# Altium schematic sheet RADC-Peripherals-S06-V00.SchDoc: RADC Peripherals (SD Card, I2C / OLED Header, USART Header)
size A3; DrawnBy: Jonn Dillon; DocumentNumber: 5; SheetNumber: 5; SheetTotal: 8; Version: 00; Project: QUTMS RADIO COMPUTE; PageSetup: Record=PageOptions|CenterHorizontal=True|CenterVertical=True|PrintScale=0.97|XCorrection=1.00|YCorrection=1.00|PrintKind=0|BorderSize=5000000|LeftOffset=0|BottomOffset=0|Orientation=2|PaperLength=1000|PaperWidth=1000|Scale=100|PaperSource=7|PrintQuality=-4|MediaType=1|DitherType=10|PaperKind=A4|PrintScaleMode=1
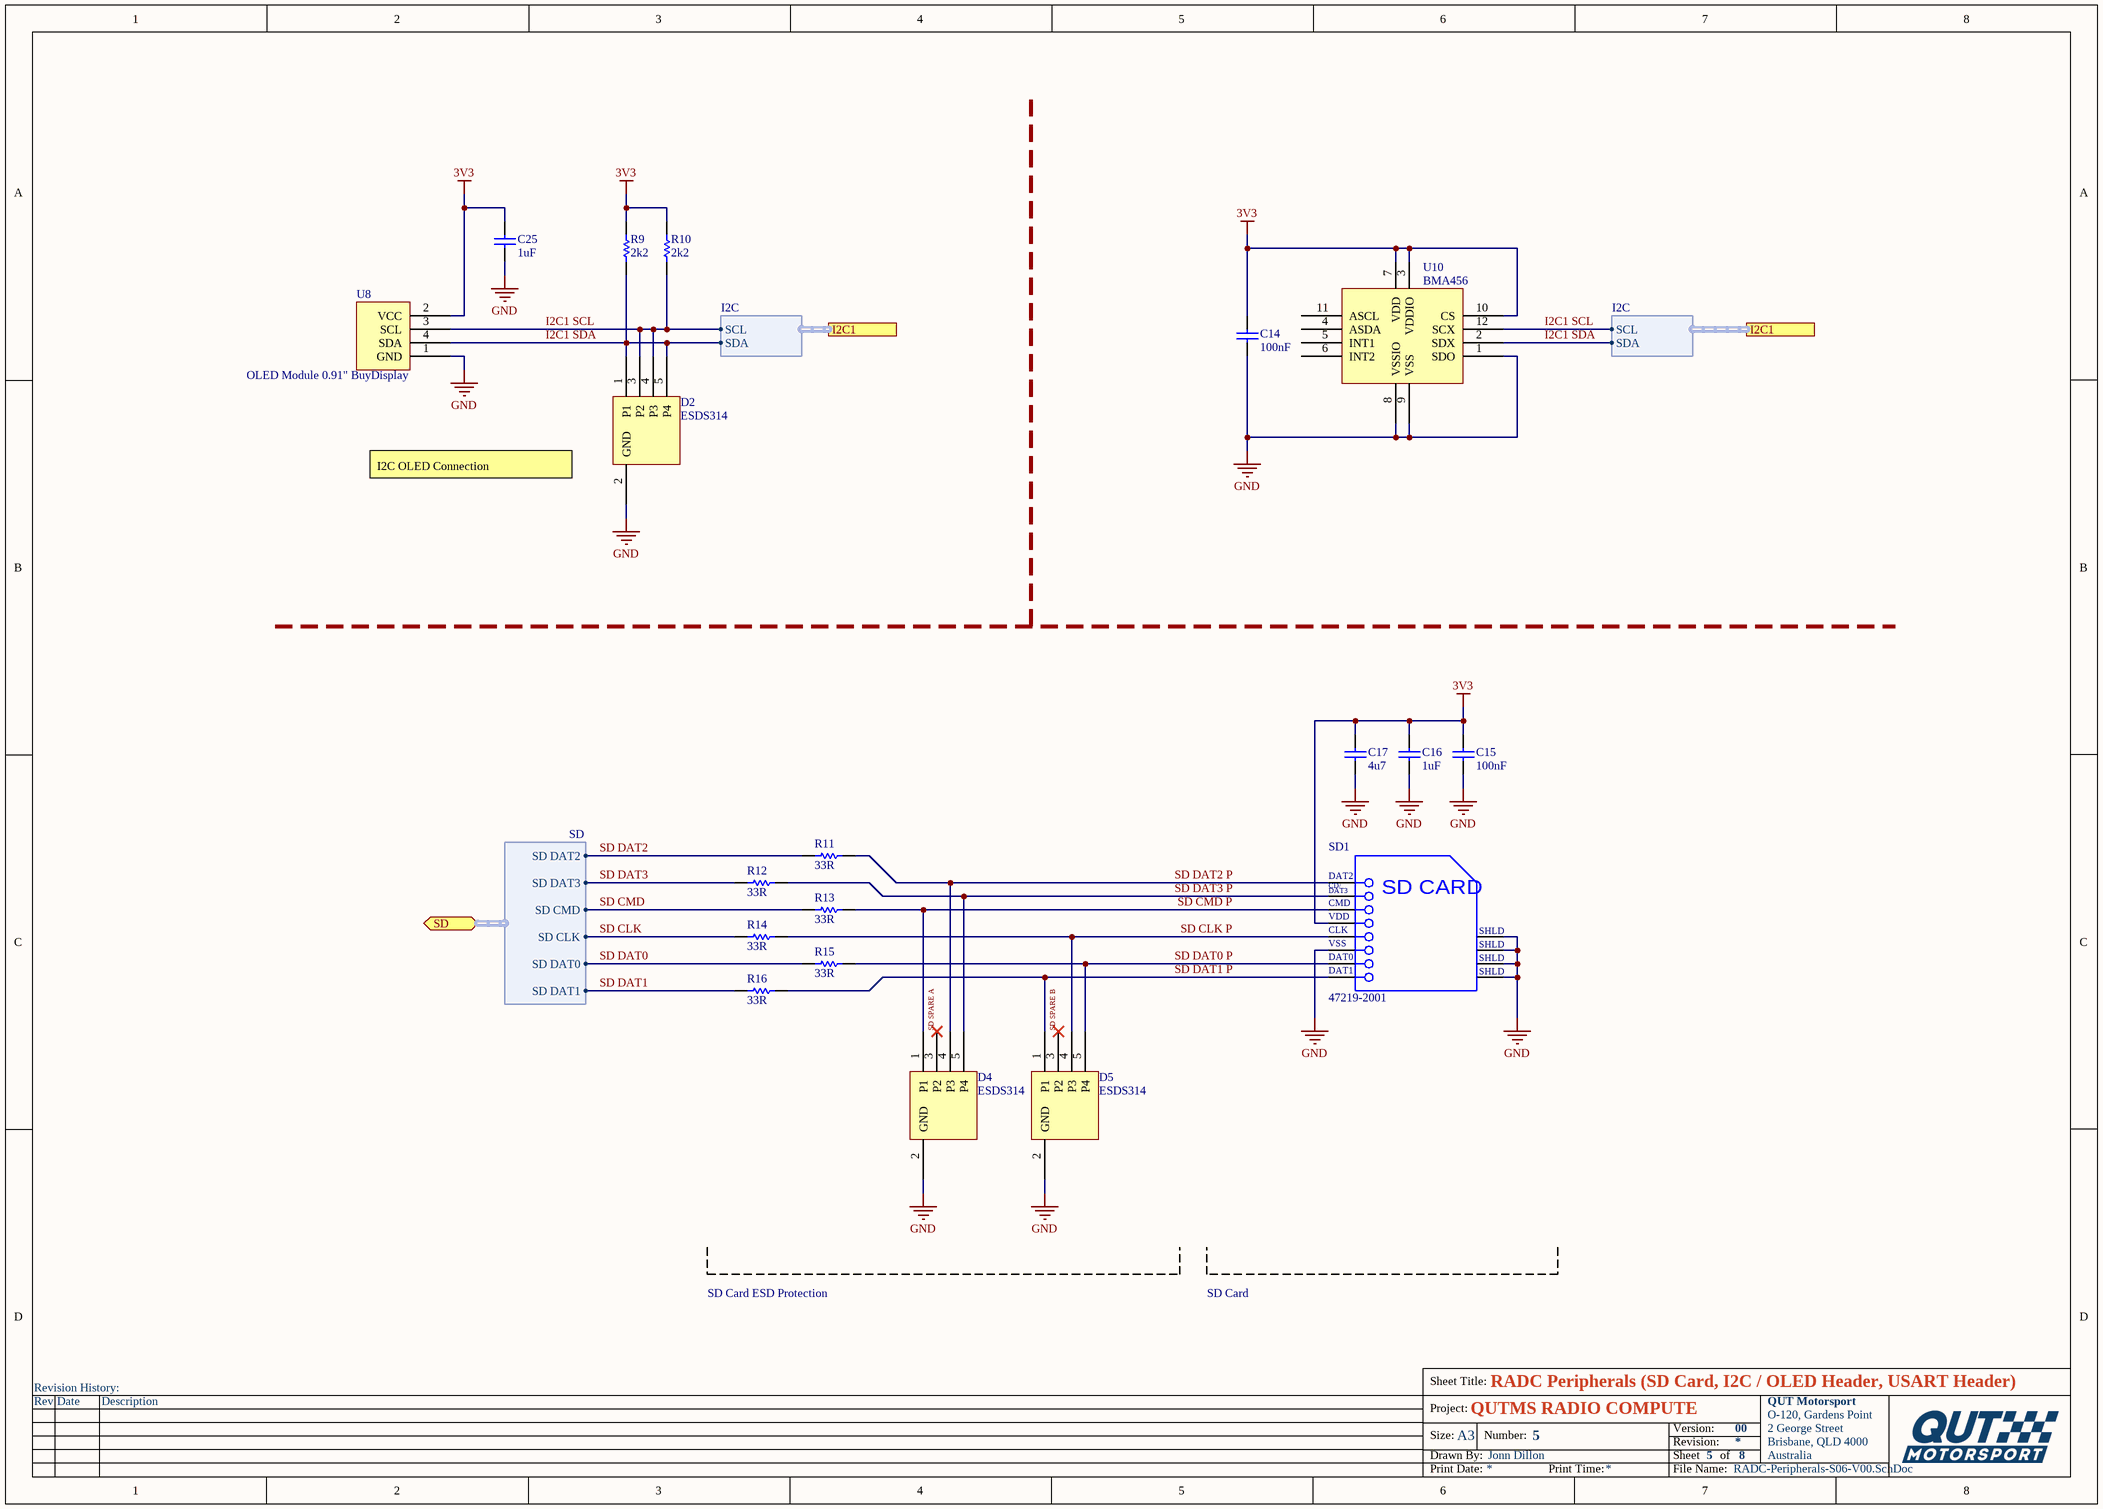
[diagram p0: RADC-Peripherals-S06-V00.SchDoc]

## Parts
C14  100nF  [Cap_Ceramic_0603]
C15  100nF  [Cap_Ceramic_0603]
C16  1uF  [Cap_Ceramic_0603]
C17  4u7  [Cap_Ceramic_0603]
C25  1uF  [Cap_Ceramic_0603]
D2  ESDS314  [SOT-23-5]
D4  ESDS314  [SOT-23-5]
D5  ESDS314  [SOT-23-5]
R9  2k2  [Res_ThinFilm_0603]
R10  2k2  [Res_ThinFilm_0603]
R11  33R  [Res_ThinFilm_0603]
R12  33R  [Res_ThinFilm_0603]
R13  33R  [Res_ThinFilm_0603]
R14  33R  [Res_ThinFilm_0603]
R15  33R  [Res_ThinFilm_0603]
R16  33R  [Res_ThinFilm_0603]
SD1  47219-2001  [47219-2001]
U8  OLED Module 0.91" BuyDisplay  [BuyDisplay 0.91" OLED]
U10  BMA456  [BMA456]

## Ports
I2C1 (harness I2C), SD (bidir, harness SD)

## Harnesses
SD: SD DAT2, SD DAT3, SD CMD, SD CLK, SD DAT0, SD DAT1
I2C: SDA, SCL

## Nets
3V3: C14.2 C15.2 C16.2 C17.2 C25.2 R9.2 R10.2 SD1.4(VDD) U8.2(VCC) U10.3(VDDIO) U10.7(VDD) U10.10(CS)
GND: C14.1 C15.1 C16.1 C17.1 C25.1 D2.2(GND) D4.2(GND) D5.2(GND) SD1.6(VSS) SD1.9(SHLD) SD1.10(SHLD) SD1.11(SHLD) SD1.12(SHLD) U8.1(GND) U10.1(SDO) U10.8(VSSIO) U10.9(VSS)
I2C1 SCL: D2.3(P2) D2.4(P3) R10.1 U8.3(SCL) U10.12(SCX) ; port I2C1.SCL
I2C1 SDA: D2.1(P1) D2.5(P4) R9.1 U8.4(SDA) U10.2(SDX) ; port I2C1.SDA
SD CLK: R14.1 ; port SD.SD CLK
SD CLK P: D5.4(P3) R14.2 SD1.5(CLK)
SD CMD: R13.1 ; port SD.SD CMD
SD CMD P: D4.1(P1) R13.2 SD1.3(CMD)
SD DAT0: R15.1 ; port SD.SD DAT0
SD DAT0 P: D5.5(P4) R15.2 SD1.7(DAT0)
SD DAT1: R16.1 ; port SD.SD DAT1
SD DAT1 P: D5.1(P1) R16.2 SD1.8(DAT1)
SD DAT2: R11.1 ; port SD.SD DAT2
SD DAT2 P: D4.4(P3) R11.2 SD1.1(DAT2)
SD DAT3: R12.1 ; port SD.SD DAT3
SD DAT3 P: D4.5(P4) R12.2 SD1.2(CD/DAT3)
SD SPARE A: D4.3(P2)
SD SPARE B: D5.3(P2)

Not connected (* = marked no-connect by the designer): U10 4(ASDA) 5(INT1) 6(INT2) 11(ASCL)

## Notes on the sheet
- I2C OLED Connection
- SD Card ESD Protection
- SD Card
- Revision History:
- Sheet Title:
- Rev
- Date
- Description
- Project:
- Size:
- Drawn By:
- A3
- Number:
- Revision:
- Sheet
- Version:
- of
- QUT Motorsport
- O-120, Gardens Point
- 2 George Street
- Brisbane, QLD 4000
- Australia
- Print Date:
- Print Time:
- File Name:
- (in symbol 47219-2001) CD/; DAT3; SD CARD

## Library data of the parts
C14 C15 = 100nF 50V 5% X7R 0603: Capacitor, Ceramic, SMD, 100nF, 50V, 5%, X7R, 0603
C16 C25 = 1uF 25V 5% X7R 0603: Capacitor, Ceramic, SMD, 1uF, 25V, 5%, X7R, 0603
C17 = 4u7 50V 5% X7R 0603: Capacitor, Ceramic, SMD, 4u7, 50V, 5%, X7R, 0603
D2 D4 D5 = ESDS314: 6.5V (Typ) Clamp 25A (8/20µs) Ipp Tvs Diode Surface Mount SOT-23-5
R9 R10 = 2k2 5% 0603: Resistor, SMD, 2k2, 0.1W, 5%, 0603
R11-R16 = 33R 5% 0603: Resistor, SMD, 33R, 0.1W, 5%, 0603
SD1 = 47219-2001: MicroSD Card Connector, Hinge Type, -40 to 85 degC, 8-Pin SMD, RoHS, Tape and Reel
U8 = OLED Module 0.91" BuyDisplay: I2C Blue 0.91" inch OLED Display Module 128x32 Arduino,Raspberry Pi
U10 = BMA456: Accelerometer X, Y, Z Axis ±2g, 4g, 8g, 16g 1.5kHz ~ 1.6kHz 12-LGA (2x2)